# EasyEDA Pro project MAX5864_REUSE.eprj, board PCB2
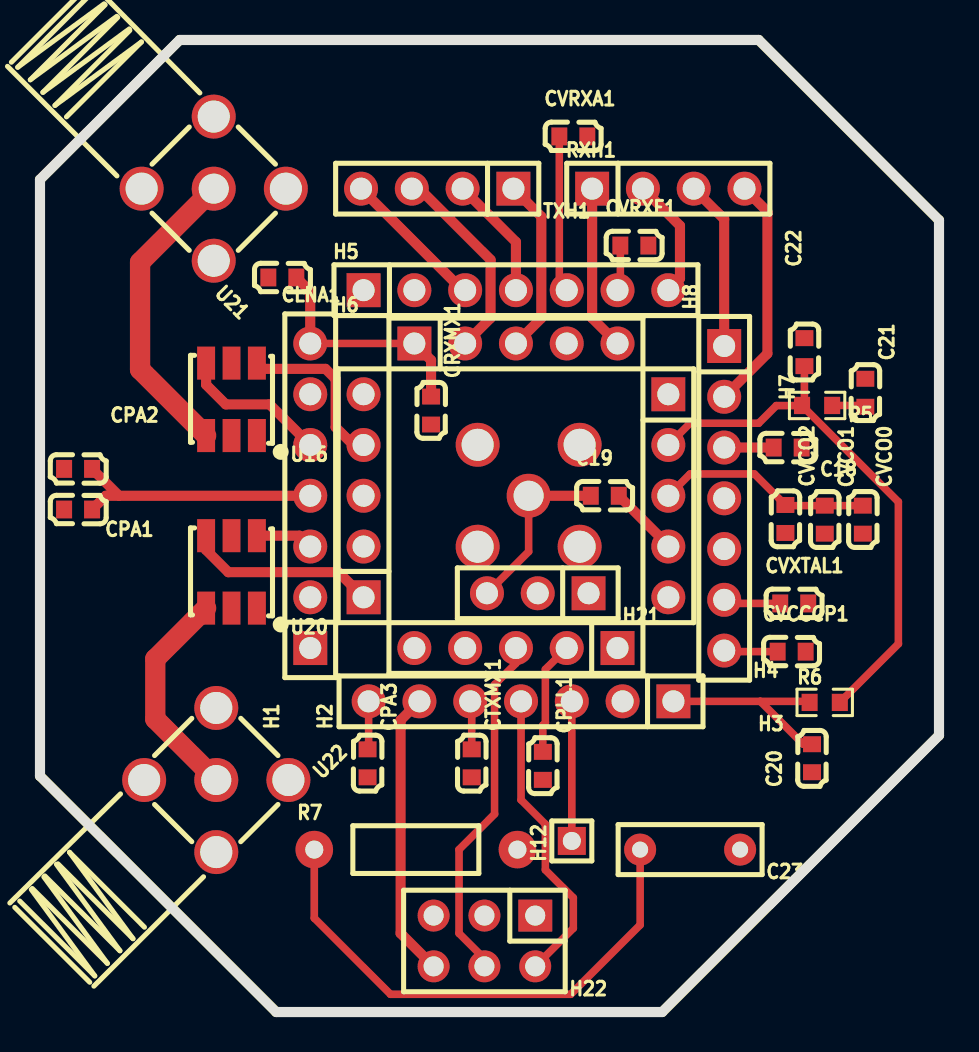
[diagram p6: board, top side]
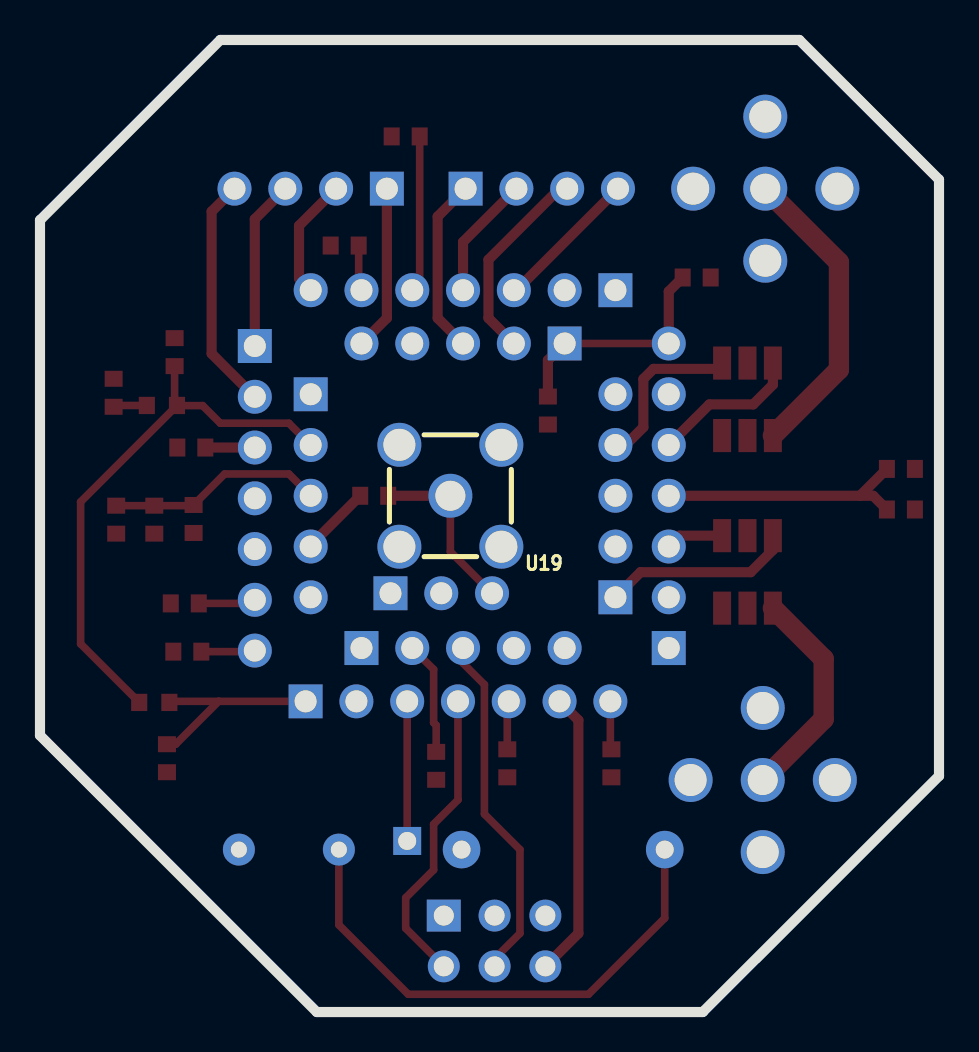
[diagram p7: board, bottom side, seen from below]

Outline 44.96 x 48.64 mm; copper layers: Top Layer, Inner1, Inner2, Inner3, Inner4, Bottom Layer. Coordinates in mm from the lower left corner of the outline.
Outline path: 0,41.66 0,11.81 11.81,0 31.11,0 44.96,13.84 44.96,39.62 35.94,48.64 6.98,48.64 0,41.66
Stack: Top Layer 0.035mm 外层铜厚1oz / Dielectric1 0.0994mm 3313 RC57% 4.2mil / Inner1 0.0152mm 内层铜厚 / Dielectric2 0.55mm 0.55mm H/H不含铜 / Inner2 0.0152mm 内层铜厚 / Dielectric3 0.1088mm 2116 RC54% 4.9mil / Inner3 0.0152mm 内层铜厚 / Dielectric4 0.55mm 0.55mm H/H不含铜 / Inner4 0.0152mm 内层铜厚 / Dielectric5 0.0994mm 3313 RC57% 4.2mil / Bottom Layer 0.035mm 外层铜厚1oz

## Design rules (mm)
template: JLCPCB Capability(Two Layers Board)
spacing copperThickness1oz (default): track to track 0.102, other pairs 0.152 to 0.3
spacing copperThickness2oz: track to track 0.203, other pairs 0.152 to 0.3
track width copperThickness1oz (default): min 0.127, default 0.254, max 2.54
track width copperThickness2oz: min 0.203, default 0.254, max 2.54
differential pair differentialPair (default): width min 0.127, default 0.254, max 2.54; gap min 0.152, default 0.152
via viaSize (default): diameter min 0.5, default 0.61, max 10; hole min 0.3, default 0.305, max 6.3

## Placement (name value [footprint] x y rotation side)
C18  100nF  [C0603]  37.39 28.25 180 top
C19  100nF  [C0603]  28.24 25.83 0 top
C20  100pF  [C0603]  38.61 12.7 90 top
C21  2200pF  [C0603]  41.28 30.99 270 top
C22  68pF  [C0603]  38.23 33.02 270 top
C23  470nF  [CAP-TH_L7.2-W2.5-P5.00-D0.5]  32.51 8.13 180 top
CLNA1  100pF  [C0603]  12.12 36.76 180 top
CPA1  10uF  [C0603]  1.91 25.15 180 top
CPA2  10uF  [C0603]  1.91 27.18 180 top
CPA3  100nF  [C0603]  16.38 12.45 270 top
CPLL1  100pF  [C0603]  25.15 12.32 270 top
CRXMX1  100pF  [C0603]  19.56 30.1 270 top
CTXMX1  100pF  [C0603]  21.59 12.45 270 top
CVCCCP1  10nF  [C0603]  37.59 18.03 0 top
CVCO0  100pF  [C0603]  41.15 24.64 270 top
CVCO1  100pF  [C0603]  39.24 24.64 270 top
CVCO2  100pF  [C0603]  37.28 24.67 270 top
CVRXA1  100pF  [C0603]  26.67 43.81 0 top
CVRXF1  100pF  [C0603]  29.72 38.35 0 top
CVXTAL1  100pF  [C0603]  37.72 20.45 0 top
H1  -  [HDR-TH_7P-P2.54-V-M]  13.51 25.83 90 top
H2  -  [HDR-TH_5P-P2.54-V-M]  16.18 25.83 90 top
H3  -  [HDR-TH_7P-P2.54-V-M]  24.06 15.55 180 top
H4  -  [HDR-TH_5P-P2.54-V-M]  23.8 18.21 180 top
H5  -  [HDR-TH_7P-P2.54-V-M]  23.8 36.12 0 top
H6  -  [HDR-TH_5P-P2.54-V-M]  23.8 33.45 0 top
H7  -  [HDR-TH_7P-P2.54-V-M]  34.22 25.71 270 top
H8  -  [HDR-TH_5P-P2.54-V-M]  31.42 25.83 270 top
H12  -  [HDR-TH_1P-V-M_XKB_X4611WV-01I-C28D40]  26.6 8.56 90 top
H21  -  [HDR-TH_3P-P2.54-V-M]  24.89 20.95 180 top
H22  -  [HDR-TH_6P-P2.54-V-F-R2-C3-S2.54]  22.22 3.56 180 top
R5  1.2k  [R0603]  38.86 30.35 180 top
R6  750  [R0603]  39.24 15.49 0 top
R7  10kΩ  [R_AXIAL-0.4]  18.8 8.13 0 top
RXH1  -  [HDR-TH_4P-P2.54-V-M]  31.42 41.2 0 top
TXH1  -  [HDR-TH_4P-P2.54-V-M]  19.86 41.2 180 top
U16  TCM2-43X+  [IND-SMD_6P-L4.1-W3.8-P1.27-TL]  9.58 30.66 180 top
U19  MCX5.08-H5  [SMA-TH_MCX5.08-H5]  24.44 25.83 0 bottom
U20  TCM2-43X+  [IND-SMD_6P-L4.1-W3.8-P1.27-TL]  9.58 22.02 180 top
U21  MCX5.08-H5  [SMA-TH_MCX5.08-H5]  8.69 41.2 135 top
U22  MCX5.08-H5  [SMA-TH_MCX5.08-H5]  8.82 11.61 225 top

## Footprints (pads in the part's own frame, mm; a bottom-side part is the same pattern mirrored in y, then rotated)
C0603
  rect 0.8x0.9 smd: 1(-0.7,0) 2(0.7,0)
CAP-TH_L7.2-W2.5-P5.00-D0.5
  round 1.6 hole 0.8: 1(-2.5,0) 2(2.5,0)
HDR-TH_1P-V-M_XKB_X4611WV-01I-C28D40
  rect 1.4x1.4 hole 0.9: 1(0,0)
HDR-TH_3P-P2.54-V-M
  rect 1.7x1.7 hole 1.1: 1(-2.54,0)
  round 1.7 hole 1.1: 2(0,0) 3(2.54,0)
HDR-TH_4P-P2.54-V-M
  rect 1.7x1.7 hole 1.1: 1(-3.81,0)
  round 1.7 hole 1.1: 2(-1.27,0) 3(1.27,0) 4(3.81,0)
HDR-TH_5P-P2.54-V-M
  rect 1.7x1.7 hole 1.1: 1(-5.08,0)
  round 1.7 hole 1.1: 2(-2.54,0) 3(0,0) 4(2.54,0) 5(5.08,0)
HDR-TH_6P-P2.54-V-F-R2-C3-S2.54
  rect 1.7x1.6 hole 1: 1(-2.54,-1.27)
  round 1.6 hole 1: 2(-2.54,1.27) 3(0,-1.27) 4(0,1.27) 5(2.54,-1.27) 6(2.54,1.27)
HDR-TH_7P-P2.54-V-M
  rect 1.7x1.7 hole 1.1: 1(-7.62,0)
  round 1.7 hole 1.1: 2(-5.08,0) 3(-2.54,0) 4(0,0) 5(2.54,0) 6(5.08,0) 7(7.62,0)
IND-SMD_6P-L4.1-W3.8-P1.27-TL
  rect 0.9x1.657 smd: 1(-1.27,1.813) 2(0,1.813) 3(1.27,1.813) 4(1.27,-1.813) 5(0,-1.813) 6(-1.27,-1.813)
R0603
  rect 0.806x0.864 smd: 1(-0.753,0) 2(0.753,0)
R_AXIAL-0.4
  round 1.879 hole 0.899: 1(-5.08,0) 2(5.08,0)
SMA-TH_MCX5.08-H5
  round 2.2 hole 1.6: 1(-2.55,-2.55) 2(-2.55,2.55) 3(2.55,2.55) 4(2.55,-2.55)
  round 2.2 hole 1.5: 5(0,0)

## Nets
As in the schematic.

Pads without a net: H22 1 3 5; U16 5; U20 5

## Routing (per net, layer and track width the routed paths; a pad name or vN(x,y) marks a point on that pad's centre or on a via; arc(x,y) is an arc through that point)
3.3: length 62
  Top Layer w0.381: H4.2 25.27,17.14 25.27,14.48 25.15,14.35 CPLL1.1 ; H1.7 H6.1 ; CVCCCP1.1 34.27,18.03 H7.7 ; H5.5 25.97,36.49 CVRXA1.1 ; CTXMX1.1 21.59,15.47 H3.5 ; H8.3 32.51,26.92 35.72,26.92 CVCO2.1 37.31,25.34 CVCO1.1 CVCO0.1 ; H7.6 34.39,20.45 CVXTAL1.1 ; H3.7 16.44,13.2 CPA3.1 ; H5.6 29.02,36.26 CVRXF1.1
  Top Layer w0.508: H1.7 13.51,36.06 CLNA1.1 ; 3.95,25.83 3.29,25.83 CPA1.1 ; 3.95,25.83 H1.4 ; 3.95,25.83 CPA2.1 ; CRXMX1.1 19.56,32.62 H6.1
BYPASS: length 2.5
  Top Layer w0.508: C18.2 H7.3
CPOUT: length 10.3
  Top Layer w0.381: 36.02,15.55 38.17,13.4 38.61,13.4 ; 36.02,15.55 H3.1 ; 36.02,15.55 38.44,15.55 R6.1
CS#: length 14.3
  Top Layer w0.508: H3.6 18.03,14.61 18.03,3.94 H22.6
DIN: length 15.1
  Top Layer w0.381: H22.2 26.67,4.19 26.67,5.72 25.27,7.11 25.27,9.4 24.06,10.62 H3.4
RSSIOUT: length 26.5
  Top Layer w0.381: R7.1 13.72,4.7 17.53,0.89 26.54,0.89 30.01,4.36 C23.2
RXIN: length 6.1
  Top Layer w0.508: H5.7 32,36.7 32,39.35 RXH1.2
RXIP: length 8.3
  Top Layer w0.508: RXH1.1 27.61,34.72 H6.5
RXN: length 7.5
  Top Layer w0.508: U16.4 8.31,31.39 9.29,30.41 11.48,30.41 H1.5
RXP: length 8.4
  Top Layer w0.508: H2.4 15.67,28.37 14.78,29.26 14.78,31.68 14.28,32.18 11.14,32.18 U16.6
RXQN: length 11.8
  Top Layer w0.508: RXH1.4 36.37,40.06 36.37,32.95 H7.2
RXQP: length 8.5
  Top Layer w0.508: H7.1 34.22,39.68 RXH1.3
SCLK: length 17.6
  Top Layer w0.381: H4.3 23.8,17.45 22.73,16.38 22.73,9.91 20.95,8.13 20.95,3.94 22.22,2.67 H22.4
TUNE: length 27.6
  Top Layer w0.381: 38.11,30.34 36.82,30.34 35.94,29.46 32.51,29.46 H8.2 ; 38.11,30.34 42.93,25.53 42.93,18.42 R6.2 ; 38.11,30.34 R5.2 38.23,30.47 C22.2
TXIN: length 10.1
  Top Layer w0.508: H6.2 22.53,34.72 22.53,37.64 18.98,41.2 TXH1.3
TXIP: length 7.3
  Top Layer w0.508: H5.3 21.13,36.12 TXH1.4
TXN: length 9.6
  Top Layer w0.508: U20.4 8.31,23.12 9.42,22.01 14.92,22.01 H2.1
TXP: length 2.9
  Top Layer w0.508: H1.3 12.97,23.84 U20.6
TXQN: length 8.9
  Top Layer w0.508: H6.3 25.07,34.72 25.07,39.8 TXH1.1
TXQP: length 6.2
  Top Layer w0.508: TXH1.2 23.8,38.53 H5.4
XTAL: length 3.6
  Top Layer w0.508: C19.2 31.42,23.36 H8.4
XTAL_IN: length 9.4
  Top Layer w0.381: H21.3 24.44,23.04 U19.5
  Top Layer w0.508: 23.93,25.83 U19.5 C19.1
$1N5448: length 1.7
  Top Layer w0.381: R5.1 41.21,30.35 C21.2
$1N7403: length 7
  Top Layer w0.381: H3.3 H12.1
$1N9841: length 10.9
  Top Layer w1.016: U20.3 5.77,17.67 5.77,14.66 U22.5
$1N9844: length 15.2
  Top Layer w1.016: U21.5 5.01,37.52 5.01,32.15 8.31,28.85
